# Altium schematic sheet USB.SchDoc
size A3; SheetNumber: 12; SheetTotal: 12
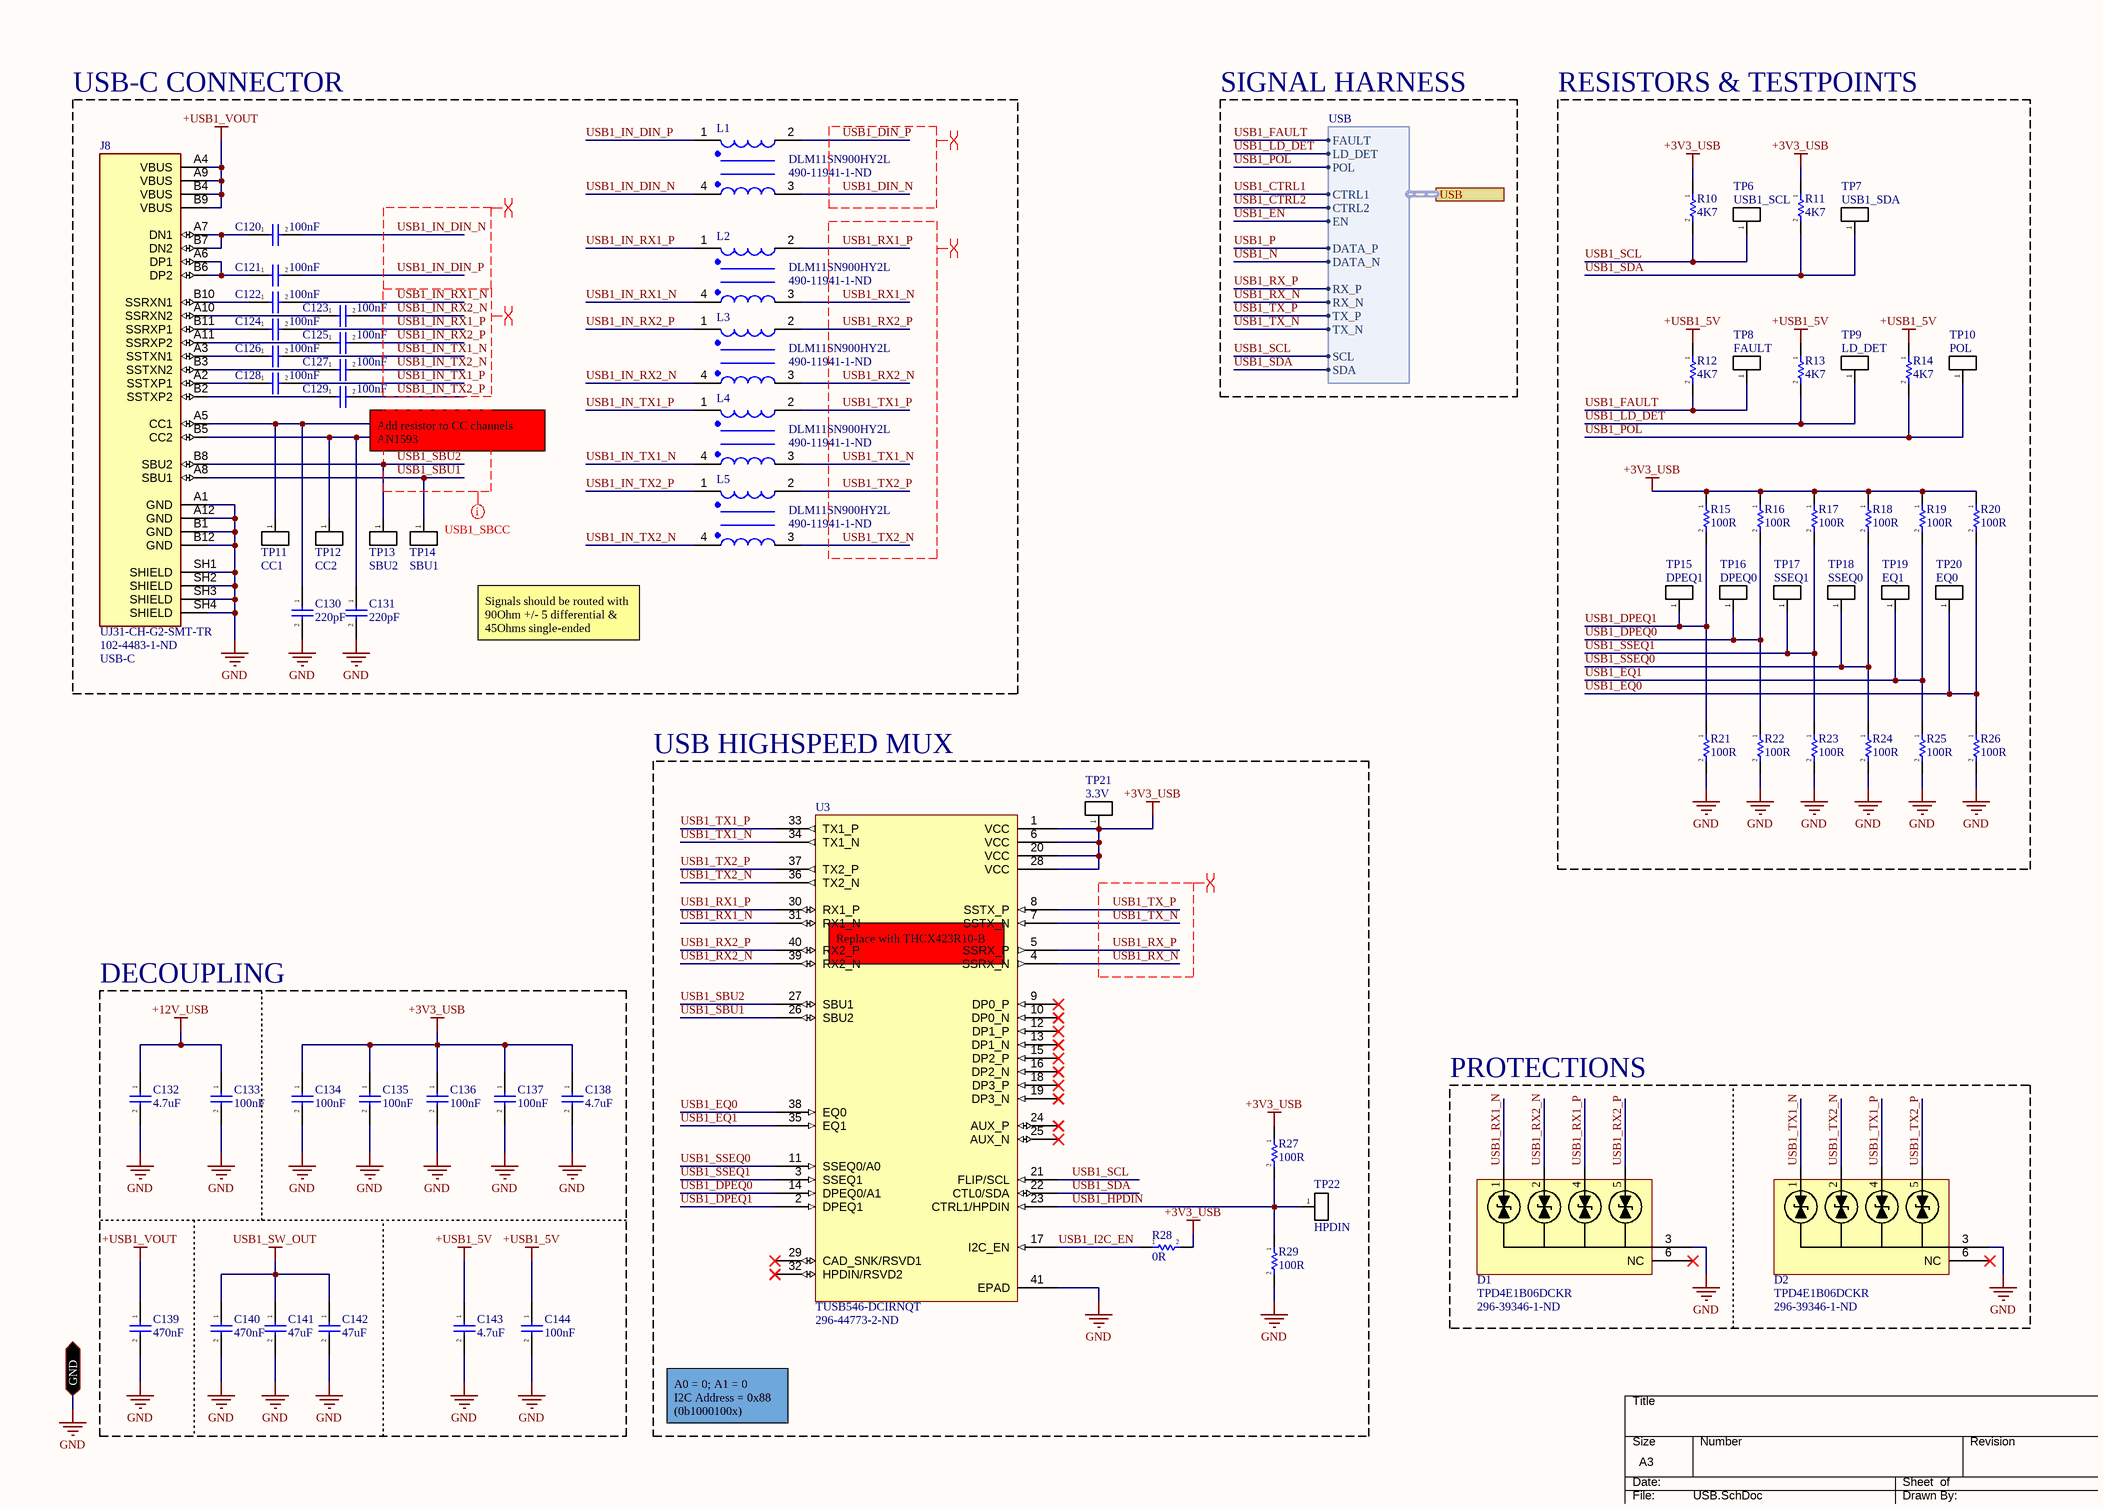
[diagram p0: USB.SchDoc]

## Parts
C120  100nF  [CAP_0402]
C121  100nF  [CAP_0402]
C122  100nF  [CAP_0402]
C123  100nF  [CAP_0402]
C124  100nF  [CAP_0402]
C125  100nF  [CAP_0402]
C126  100nF  [CAP_0402]
C127  100nF  [CAP_0402]
C128  100nF  [CAP_0402]
C129  100nF  [CAP_0402]
C130  220pF  [CAP_0402]
C131  220pF  [CAP_0402]
C132  4.7uF  [CAP_0805]
C133  100nF  [CAP_0402]
C134  100nF  [CAP_0402]
C135  100nF  [CAP_0402]
C136  100nF  [CAP_0402]
C137  100nF  [CAP_0402]
C138  4.7uF  [CAP_0805]
C139  470nF  [CAP_0402]
C140  470nF  [CAP_0402]
C141  47uF  [CAP_1206]
C142  47uF  [CAP_1206]
C143  4.7uF  [CAP_0805]
C144  100nF  [CAP_0402]
D1  TPD4E1B06DCKR  Supplier Part Number 1: 296-39346-1-ND  [TPD4E1B06DCKR]
D2  TPD4E1B06DCKR  Supplier Part Number 1: 296-39346-1-ND  [TPD4E1B06DCKR]
J8  UJ31-CH-G2-SMT-TR  Connector Type: USB-C  Supplier Part Number 1: 102-4483-1-ND  [UJ31-CH-G2-SMT-TR]
L1  DLM11SN900HY2L  Supplier Part Number 1: 490-11941-1-ND  [DLM11SN900HY2L]
L2  DLM11SN900HY2L  Supplier Part Number 1: 490-11941-1-ND  [DLM11SN900HY2L]
L3  DLM11SN900HY2L  Supplier Part Number 1: 490-11941-1-ND  [DLM11SN900HY2L]
L4  DLM11SN900HY2L  Supplier Part Number 1: 490-11941-1-ND  [DLM11SN900HY2L]
L5  DLM11SN900HY2L  Supplier Part Number 1: 490-11941-1-ND  [DLM11SN900HY2L]
R10  4K7  [RES_0603]
R11  4K7  [RES_0603]
R12  4K7  [RES_0603]
R13  4K7  [RES_0603]
R14  4K7  [RES_0603]
R15  100R  [RES_0402]
R16  100R  [RES_0402]
R17  100R  [RES_0402]
R18  100R  [RES_0402]
R19  100R  [RES_0402]
R20  100R  [RES_0402]
R21  100R  [RES_0402]
R22  100R  [RES_0402]
R23  100R  [RES_0402]
R24  100R  [RES_0402]
R25  100R  [RES_0402]
R26  100R  [RES_0402]
R27  100R  [RES_0402]
R28  0R  [RES_0603]
R29  100R  [RES_0402]
TP6  USB1_SCL  [TP_PAD_SMALL]  (no BOM)
TP7  USB1_SDA  [TP_PAD_SMALL]  (no BOM)
TP8  FAULT  [TP_PAD_TINY]  (no BOM)
TP9  LD_DET  [TP_PAD_TINY]  (no BOM)
TP10  POL  [TP_PAD_TINY]  (no BOM)
TP11  CC1  [TP_PAD_TINY]  (no BOM)
TP12  CC2  [TP_PAD_TINY]  (no BOM)
TP13  SBU2  [TP_PAD_TINY]  (no BOM)
TP14  SBU1  [TP_PAD_TINY]  (no BOM)
TP15  DPEQ1  [TP_PAD_TINY]  (no BOM)
TP16  DPEQ0  [TP_PAD_TINY]  (no BOM)
TP17  SSEQ1  [TP_PAD_TINY]  (no BOM)
TP18  SSEQ0  [TP_PAD_TINY]  (no BOM)
TP19  EQ1  [TP_PAD_TINY]  (no BOM)
TP20  EQ0  [TP_PAD_TINY]  (no BOM)
TP21  3.3V  [TP_PAD]  (no BOM)
TP22  HPDIN  [TP_PAD_TINY]  (no BOM)
U3  TUSB546-DCIRNQT  Supplier Part Number 1: 296-44773-2-ND  [TUSB546-DCIRNQT]

## Blocks framed on the sheet
USB-C CONNECTOR: C120-C131 J8 L1-L5 TP11-TP14
RESISTORS & TESTPOINTS: R10-R26 TP6-TP10 TP15-TP20
USB HIGHSPEED MUX: R27-R29 TP21 TP22 U3
DECOUPLING: C132-C144
PROTECTIONS: D1 D2

## Ports
GND (bidir), USB (harness USB)

## Harnesses
USB: FAULT, LD_DET, POL, CTRL1, CTRL2, EN, DATA_P, DATA_N, RX_P, RX_N, TX_P, TX_N, SCL, SDA

## Nets
+3V3_USB: C134.1 C135.1 C136.1 C137.1 C138.1 R10.1 R11.1 R15.1 R16.1 R17.1 R18.1 R19.1 R20.1 R27.1 R28.2 TP21.1(A) U3.1(VCC) U3.6(VCC) U3.20(VCC) U3.28(VCC)
+12V_USB: C132.1 C133.1
+USB1_5V: C143.1 C144.1 R12.1 R13.1 R14.1
+USB1_VOUT: C139.1 J8.A4(VBUS) J8.A9(VBUS) J8.B4(VBUS) J8.B9(VBUS)
GND: C130.2 C131.2 C132.2 C133.2 C134.2 C135.2 C136.2 C137.2 C138.2 C139.2 C140.2 C141.2 C142.2 C143.2 C144.2 D1.3(GND) D2.3(GND) J8.A1(GND) J8.A12(GND) J8.B1(GND) J8.B12(GND) J8.SH1(SHIELD) J8.SH2(SHIELD) J8.SH3(SHIELD) J8.SH4(SHIELD) R21.2 R22.2 R23.2 R24.2 R25.2 R26.2 R29.2 U3.41(EPAD) ; port GND
USB1_SW_OUT: C140.1 C141.1 C142.1
USB1_CC1: C130.1 J8.A5(CC1) TP11.1(A)
USB1_CC2: C131.1 J8.B5(CC2) TP12.1(A)
USB1_CTRL1: port USB.CTRL1
USB1_CTRL2: port USB.CTRL2
USB1_DIN_N: L1.3
USB1_DIN_P: L1.2
USB1_DPEQ0: R16.2 R22.1 TP16.1(A) U3.14(DPEQ0/A1)
USB1_DPEQ1: R15.2 R21.1 TP15.1(A) U3.2(DPEQ1)
USB1_EN: port USB.EN
USB1_EQ0: R20.2 R26.1 TP20.1(A) U3.38(EQ0)
USB1_EQ1: R19.2 R25.1 TP19.1(A) U3.35(EQ1)
USB1_FAULT: R12.2 TP8.1(A) ; port USB.FAULT
USB1_HPDIN: R27.2 R29.1 TP22.1(A) U3.23(CTRL1/HPDIN)
USB1_I2C_EN: R28.1 U3.17(I2C_EN)
USB1_IN_DIN_N: C120.2 L1.4
USB1_IN_DIN_P: C121.2 L1.1
USB1_IN_RX1_N: C122.2 L2.4
USB1_IN_RX1_P: C124.2 L2.1
USB1_IN_RX2_N: C123.2 L3.4
USB1_IN_RX2_P: C125.2 L3.1
USB1_IN_TX1_N: C126.2 L4.4
USB1_IN_TX1_P: C128.2 L4.1
USB1_IN_TX2_N: C127.2 L5.4
USB1_IN_TX2_P: C129.2 L5.1
USB1_LD_DET: R13.2 TP9.1(A) ; port USB.LD_DET
USB1_N: port USB.DATA_N
USB1_P: port USB.DATA_P
USB1_POL: R14.2 TP10.1(A) ; port USB.POL
USB1_RX1_N: D1.1(A) L2.3 U3.31(RX1_N)
USB1_RX1_P: D1.4(A) L2.2 U3.30(RX1_P)
USB1_RX2_N: D1.2(A) L3.3 U3.39(RX2_N)
USB1_RX2_P: D1.5(A) L3.2 U3.40(RX2_P)
USB1_RX_N: U3.4(SSRX_N) ; port USB.RX_N
USB1_RX_P: U3.5(SSRX_P) ; port USB.RX_P
USB1_SBU1: J8.A8(SBU1) TP14.1(A) U3.26(SBU2)
USB1_SBU2: J8.B8(SBU2) TP13.1(A) U3.27(SBU1)
USB1_SCL: R10.2 TP6.1(A) U3.21(FLIP/SCL) ; port USB.SCL
USB1_SDA: R11.2 TP7.1(A) U3.22(CTL0/SDA) ; port USB.SDA
USB1_SSEQ0: R18.2 R24.1 TP18.1(A) U3.11(SSEQ0/A0)
USB1_SSEQ1: R17.2 R23.1 TP17.1(A) U3.3(SSEQ1)
USB1_TX1_N: D2.1(A) L4.3 U3.34(TX1_N)
USB1_TX1_P: D2.4(A) L4.2 U3.33(TX1_P)
USB1_TX2_N: D2.2(A) L5.3 U3.36(TX2_N)
USB1_TX2_P: D2.5(A) L5.2 U3.37(TX2_P)
USB1_TX_N: U3.7(SSTX_N) ; port USB.TX_N
USB1_TX_P: U3.8(SSTX_P) ; port USB.TX_P
NetC120_1: C120.1 J8.A7(DN1) J8.B7(DN2)
NetC121_1: C121.1 J8.A6(DP1) J8.B6(DP2)
NetC122_1: C122.1 J8.B10(SSRXN1)
NetC123_1: C123.1 J8.A10(SSRXN2)
NetC124_1: C124.1 J8.B11(SSRXP1)
NetC125_1: C125.1 J8.A11(SSRXP2)
NetC126_1: C126.1 J8.A3(SSTXN1)
NetC127_1: C127.1 J8.B3(SSTXN2)
NetC128_1: C128.1 J8.A2(SSTXP1)
NetC129_1: C129.1 J8.B2(SSTXP2)

Not connected (* = marked no-connect by the designer): D1 6(NC)*; D2 6(NC)*; U3 9(DP0_P)* 10(DP0_N)* 12(DP1_P)* 13(DP1_N)* 15(DP2_P)* 16(DP2_N)* 18(DP3_P)* 19(DP3_N)* 24(AUX_P)* 25(AUX_N)* 29(CAD_SNK/RSVD1)* 32(HPDIN/RSVD2)*

## Layout directives
differential pair; net class USB: USB1_DIN_N, USB1_DIN_P, USB1_IN_DIN_N, USB1_IN_DIN_P, USB1_RX_N, USB1_RX_P, USB1_TX_N, USB1_TX_P
differential pair; net class USB; net class USB_SS: USB1_IN_RX1_N, USB1_IN_RX1_P, USB1_IN_RX2_N, USB1_IN_RX2_P, USB1_IN_TX1_N, USB1_IN_TX1_P, USB1_IN_TX2_N, USB1_IN_TX2_P, USB1_RX1_N, USB1_RX1_P, USB1_RX2_N, USB1_RX2_P, USB1_TX1_N, USB1_TX1_P, USB1_TX2_N, USB1_TX2_P
net class USB: USB1_CC1, USB1_CC2, USB1_SBU1, USB1_SBU2

## Notes on the sheet
- SIGNAL HARNESS
- (near C129) Add resistor to CC channels
  AN1593
- Signals should be routed with 90Ohm +/- 5 differential & 45Ohms single-ended
- (near U3) Replace with THCX423R10-B
- A0 = 0; A1 = 0
  I2C Address = 0x88
  (0b1000100x)
- DWG NO:
- REV:
- THIS DOCUMENT AND THE DATA DISCLOSED HEREIN OR
- HEREWITH IS THE PROPERTY OF ALTIUM LIMITED AND MAY
- BE FREELY DISTRIBUTED IN WHOLE. NO RIGHTS ARE
- RESERVED OR EXPRESS OR IMPLIED WARANTEE GIVEN.
- REVISION
- DESCRIPTION
- DATE
- APPROVED
- ENG:
- APPROVALS
- PROJECT
- DSN:
- CHK:
- REFERENCE DOCUMENTS
- PROJECT REVISION:
- TITLE
- DOCUMENT REVISION:
- DESIGN ITEM:
- BOM:
- FAB DWG:
- PCB DWG:
- ASSY DWG:
- SCALE:
- FILE NAME
- A2
- SIZE
- CAGE CODE
- DWG NO.
- SHEET
- OF
- REV

## Library data of the parts
C120-C144 = CAP_CER: Generic SMT Ceramic Capacitor; Voltage - Rated: 25V; Operating Temperature: *; Tolerance: *; Mfr: *; ComponentLink1Description: Digikey; ComponentLink1URL: [Digikey Link]; Digikey Part No: *; ComponentLink2Description: Datasheet; ComponentLink2URL: [Datasheet Link]
  C120-C131 C133-C137 C139 C140 C144: Footprint: 0402
  C132 C138 C143: Footprint: 0805
  C141 C142: Footprint: 1206
D1 D2 = DIODE_TPD4E1B06DCKR: TVS DIODE 5.5VWM 14.5VC SC70-6; Mfr: Texas Instruments; Voltage - Reverse: 5.5V; Breakdown Voltage: 7V; Clamping Voltage: 14.5V; Current Peak (10/1ms): 3A; Power Peak: 45W; Operating Temperature: -40C - 125C; Supplier 1: Digi-Key
J8 = CONN_UJ31-CH-G2-SMT-TR: Type C, USB 3.1 Gen 2, 5 A, Right Angle, Surface Mount _SMT_, USB Receptacle; Mfr: CUI Devices; Number of Contacts: 24; Specifications: USB 3.2 Gen 2 (USB 3.1 Gen 2, Superspeed + (USB 3.1)); Current Rating: 6.25A; Voltage Rating: 20V; Operating Temperature: -25C - 80C; Digikey Part Number: 102-4483-1-ND; ComponentLink1Description: Digikey; ComponentLink1URL: https://www.digikey.ca/en/products/detail/cui-devices/UJ31-CH-G2-SMT-TR/8024057; Supplier 1: Digi-Key
L1-L5 = IND_DLM11SN900HY2L: 2 Line Common Mode Choke Surface Mount 90 Ohms @ 100MHz 100mA DCR 1.38Ohm; Voltage Rating: 5V; Impedance: 90 Ohms @ 100MHz; Current Rating: 100mA; DC resistance: 1.38Ohm; Operating Temperature: -40C - 85C; Package: 0504; Supplier 1: Digi-Key
R10-R14 = RESISTOR: Power: 1/16W; Tolerance: 10%; Automotive: *; Operating Temperature: *; # Digikey: *; ComponentLink1Description: Digikey; ComponentLink1URL: *; # Manufacturer: *; Package / Case: 0603
R15-R29 = RESISTOR: Power: 1/8W; Tolerance: 10%; Automotive: *; Operating Temperature: *; # Digikey: *; ComponentLink1Description: Digikey; ComponentLink1URL: *; # Manufacturer: *
  R15-R27 R29: Package / Case: 0402
  R28: Package / Case: 0603
TP6-TP22 = TESTPOINT: Test Point
U3 = IC_TUSB546-DCIRNQT: Buffer, ReDriver 2 Channel 8.1Gbps 40-WQFN (4x6); Mfr: Texas Instruments; Supply Voltage: 3.3V - 3.6V; Operating Temperature: 0C - 70C; Supplier 1: Digi-Key